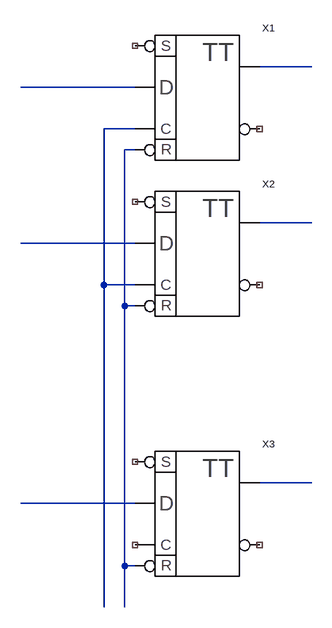
[diagram p0: schematic Draft3.asc]
Draft3.asc, the LTspice schematic file:
Version 4
SHEET 1 880 1044
WIRE 448 80 368 80
WIRE 176 112 0 112
WIRE 176 176 128 176
WIRE 176 208 160 208
WIRE 448 320 368 320
WIRE 176 352 0 352
WIRE 128 416 128 176
WIRE 176 416 128 416
WIRE 160 448 160 208
WIRE 176 448 160 448
WIRE 448 720 368 720
WIRE 176 752 0 752
WIRE 160 848 160 448
WIRE 176 848 160 848
WIRE 128 912 128 416
WIRE 160 912 160 848
SYMBOL dTrig 272 128 R0
SYMATTR InstName X1
SYMBOL dTrig 272 368 R0
SYMATTR InstName X2
SYMBOL dTrig 272 768 R0
SYMATTR InstName X3

The netlist it stands for:
* Draft3.asc
XX1 NC_01 N002 N003 N004 N001 NC_02 dTrig  ; pins s d c r q nq
XX2 NC_03 N006 N003 N004 N005 NC_04 dTrig  ; pins s d c r q nq
XX3 NC_05 N008 NC_06 N004 N007 NC_07 dTrig  ; pins s d c r q nq
.backanno
.end